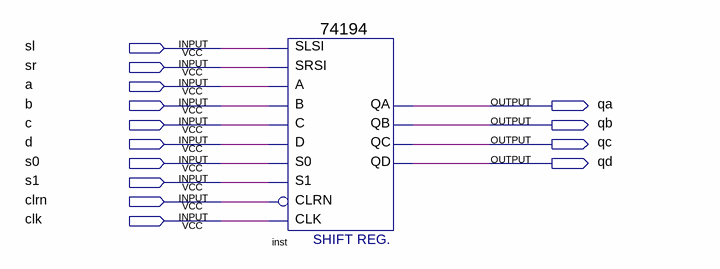
[diagram p0: schematic sheet]
// Quartus schematic exp71494.bdf as structural Verilog: 1 symbols, 14 pins
module exp71494 (
  input  sl,
  input  sr,
  input  a,
  input  b,
  input  c,
  input  d,
  input  s0,
  input  s1,
  input  clrn,
  input  clk,
  output qa,
  output qb,
  output qc,
  output qd
);

  \74194  inst (
    .SLSI(sl), .SRSI(sr), .B(b), .C(c), .CLK(clk), .CLRN(clrn), .D(d), .S1(s1), .S0(s0), .A(a), .QA(qa),
    .QB(qb), .QC(qc), .QD(qd));
endmodule
